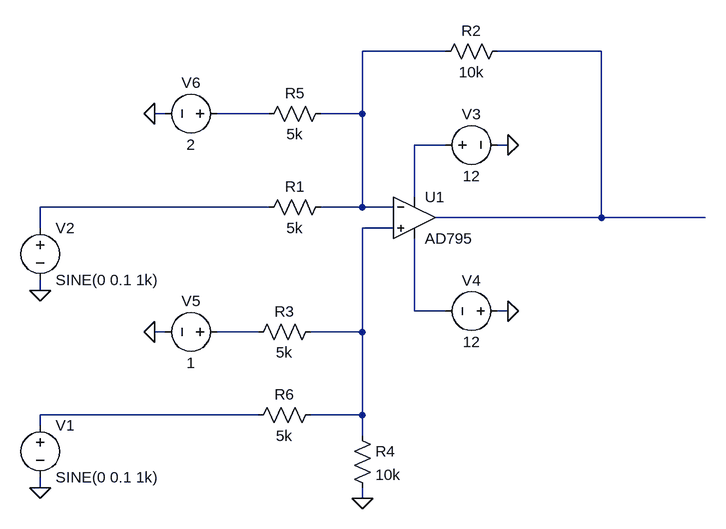
[diagram p0: schematic t2.asc]
t2.asc, the LTspice schematic file:
Version 4.1
SHEET 1 880 680
WIRE 288 -80 160 -80
WIRE 528 -80 368 -80
WIRE -144 16 -160 16
WIRE 16 16 -64 16
WIRE 160 16 160 -80
WIRE 160 16 96 16
WIRE 288 64 240 64
WIRE 384 64 368 64
WIRE 240 144 240 64
WIRE 16 160 -336 160
WIRE 160 160 160 16
WIRE 160 160 96 160
WIRE 208 160 160 160
WIRE 528 176 528 -80
WIRE 528 176 272 176
WIRE 688 176 528 176
WIRE -336 192 -336 160
WIRE 208 192 160 192
WIRE -336 288 -336 272
WIRE 240 320 240 208
WIRE 288 320 240 320
WIRE 384 320 368 320
WIRE -144 352 -160 352
WIRE 0 352 -64 352
WIRE 160 352 160 192
WIRE 160 352 80 352
WIRE 0 480 -336 480
WIRE 160 480 160 352
WIRE 160 480 80 480
WIRE -336 496 -336 480
WIRE 160 512 160 480
WIRE -336 592 -336 576
WIRE 160 608 160 592
FLAG -336 288 0
FLAG -336 592 0
FLAG -160 352 0
FLAG -160 16 0
FLAG 384 64 0
FLAG 384 320 0
FLAG 160 608 0
SYMBOL OpAmps\\AD795 240 112 R0
SYMATTR InstName U1
SYMBOL res 112 144 R90
WINDOW 0 0 56 VBottom 2
WINDOW 3 32 56 VTop 2
SYMATTR InstName R1
SYMATTR Value 5k
SYMBOL res 384 -96 R90
WINDOW 0 0 56 VBottom 2
WINDOW 3 32 56 VTop 2
SYMATTR InstName R2
SYMATTR Value 10k
SYMBOL res 96 336 R90
WINDOW 0 0 56 VBottom 2
WINDOW 3 32 56 VTop 2
SYMATTR InstName R3
SYMATTR Value 5k
SYMBOL res 144 496 R0
SYMATTR InstName R4
SYMATTR Value 10k
SYMBOL res 112 0 R90
WINDOW 0 0 56 VBottom 2
WINDOW 3 32 56 VTop 2
SYMATTR InstName R5
SYMATTR Value 5k
SYMBOL res 96 464 R90
WINDOW 0 0 56 VBottom 2
WINDOW 3 32 56 VTop 2
SYMATTR InstName R6
SYMATTR Value 5k
SYMBOL voltage -336 480 R0
WINDOW 123 0 0 Left 0
WINDOW 39 0 0 Left 0
SYMATTR InstName V1
SYMATTR Value SINE(0 0.1 1k)
SYMBOL voltage -336 176 R0
WINDOW 123 0 0 Left 0
WINDOW 39 0 0 Left 0
SYMATTR InstName V2
SYMATTR Value SINE(0 0.1 1k)
SYMBOL voltage 272 64 R270
WINDOW 0 32 56 VTop 2
WINDOW 3 -32 56 VBottom 2
WINDOW 123 0 0 Left 0
WINDOW 39 0 0 Left 0
SYMATTR InstName V3
SYMATTR Value 12
SYMBOL voltage 384 320 R90
WINDOW 0 -32 56 VBottom 2
WINDOW 3 32 56 VTop 2
WINDOW 123 0 0 Left 0
WINDOW 39 0 0 Left 0
SYMATTR InstName V4
SYMATTR Value 12
SYMBOL voltage -48 352 R90
WINDOW 0 -32 56 VBottom 2
WINDOW 3 32 56 VTop 2
WINDOW 123 0 0 Left 0
WINDOW 39 0 0 Left 0
SYMATTR InstName V5
SYMATTR Value 1
SYMBOL voltage -48 16 R90
WINDOW 0 -32 56 VBottom 2
WINDOW 3 32 56 VTop 2
WINDOW 123 0 0 Left 0
WINDOW 39 0 0 Left 0
SYMATTR InstName V6
SYMATTR Value 2

The netlist it stands for:
* t2.asc
X§U1 N006 N001 N004 N007 N002 AD795  ; pins In+ In- V+ V- OUT
R1 N001 N005 5k
R2 N002 N001 10k
R3 N006 N008 5k
R4 N006 0 10k
R5 N001 N003 5k
R6 N006 N009 5k
V1 N009 0 SINE(0 0.1 1k)
V2 N005 0 SINE(0 0.1 1k)
V3 N004 0 12
V4 0 N007 12
V5 N008 0 1
V6 N003 0 2
.lib ADI1.lib
.backanno
.end